# Altium schematic sheet SHEET1.SCHDOC
size A4
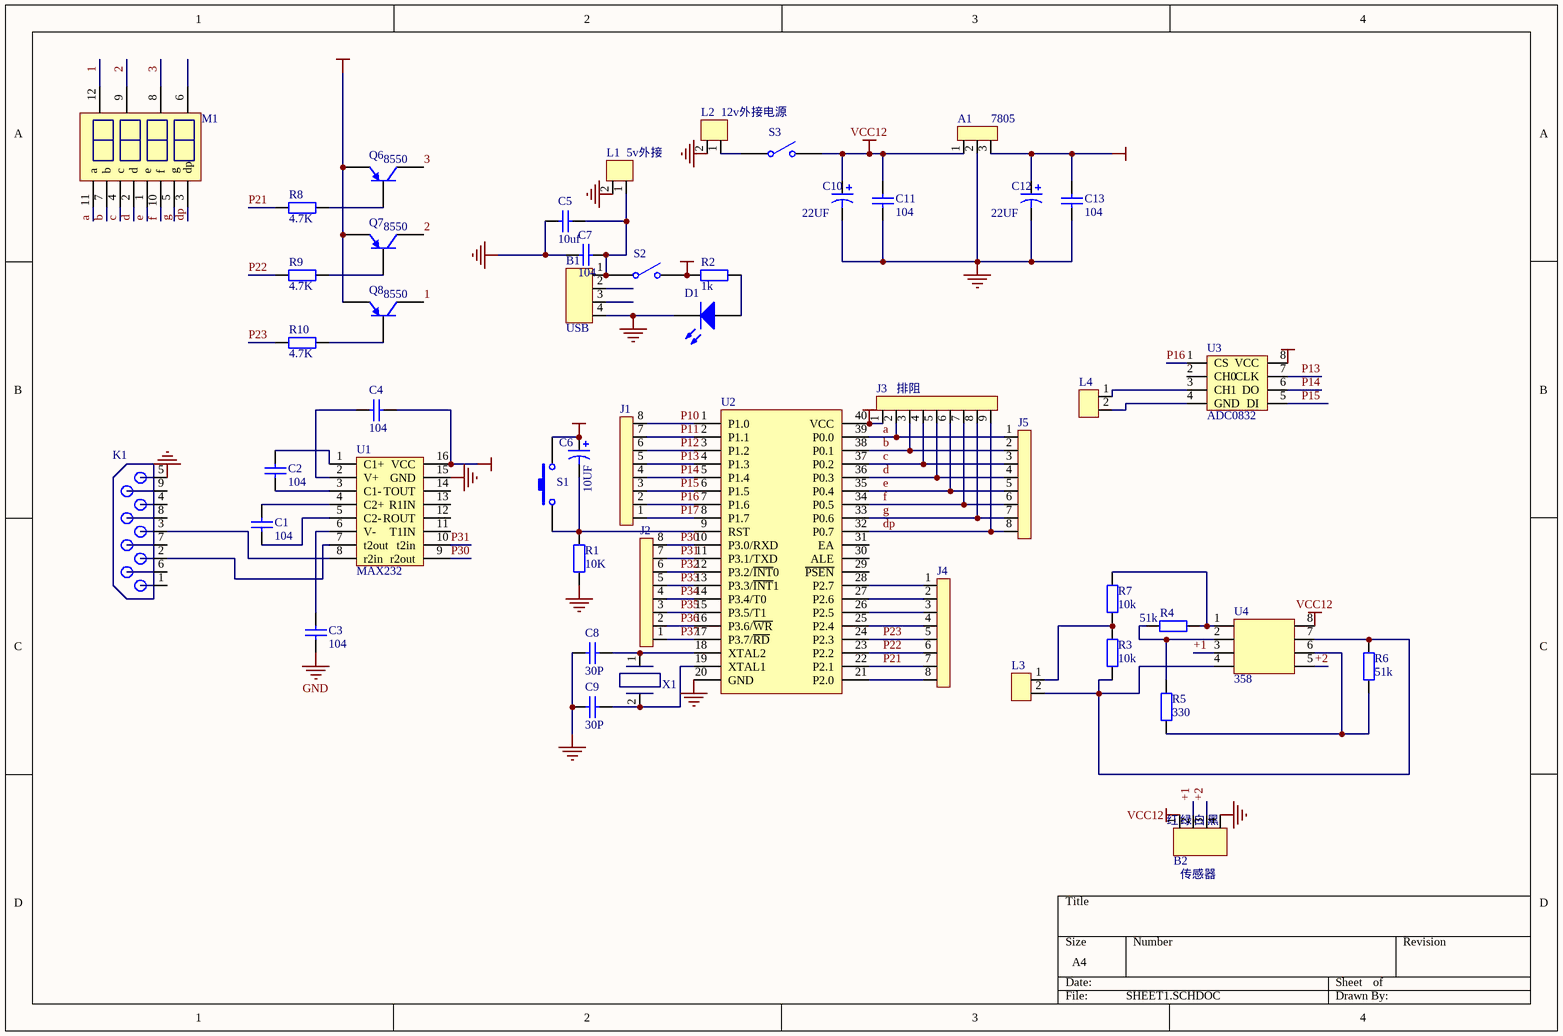
[diagram p0: SHEET1.SCHDOC]

## Parts
A1  7805  [P-3]
B1  USB  [USB]
B2  传感器  [P-4]
C1  104  [P-2]
C2  104  [P-2]
C3  104  [P-2]
C4  104  [P-2]
C5  10uf  [P-2]
C6  10UF  [P-2有源]
C7  104  [P-2]
C8  30P  [P-2]
C9  30P  [P-2]
C10  22UF  [P-2有源]
C11  104  [P-2]
C12  22UF  [P-2有源]
C13  104  [P-2]
D1  HLMA-PH00-N0014  [P-2有源]  (value not drawn)
J1  P-8  [P-8]  (value not drawn)
J2  P-8  [P-8]  (value not drawn)
J3  排阻  [P-9]
J4  P-8  [P-8]  (value not drawn)
J5  P-8  [P-8]  (value not drawn)
K1  串口  [串口]  (value not drawn)
L1  5v外接  [P-2]
L2  12v外接电源  [P-2]
L3  12v外接电源  [P-2]  (value not drawn)
L4  12v外接电源  [P-2]  (value not drawn)
M1  数码管  [数码管]  (value not drawn)
Q6  8550  [P-3]
Q7  8550  [P-3]
Q8  8550  [P-3]
R1  10K  [电阻]
R2  1k  [电阻]
R3  10k  [电阻]
R4  51k  [电阻]
R5  330  [电阻]
R6  51k  [电阻]
R7  10k  [电阻]
R8  4.7K  [电阻]
R9  4.7K  [电阻]
R10  4.7K  [电阻]
S1  SW-PB  [按键]  (value not drawn)
S2  SW-SPST  [LOCK KEY]  (value not drawn)
S3  SW-SPST  [LOCK KEY]  (value not drawn)
U1  MAX232  [DIP-16]
U2  89C52  [单片机]  (value not drawn)
U3  ADC0832  [DIP-8]
U4  358  [DIP-8]
X1  晶振  [晶振]  (value not drawn)

## Nets
GND: A1.2 B1.4(e) B2.4(e) C3.1 C5.1 C7.1 C8.1 C9.1 C10.2 C11.1 C12.2 C13.1 D1.2(K) K1.5 L1.2(SER) L2.2(SER) R1.1 U1.15(GND) U2.20(GND)
VCC: A1.3 C4.2 C6.1 C12.1 C13.2 J3.1(e) Q6.1(E) Q7.1(E) Q8.1(E) R2.1 S1.2 S2.2(NO) U1.16(VCC) U2.40(VCC) U3.8(VCC)
VCC12: A1.1 B2.1(e) C10.1 C11.2 S3.2(NO) U4.8
1: M1.12(dp) Q8.3(C)
2: M1.9(dp) Q7.3(C)
3: M1.8(dp) Q6.3(C)
+1: B2.2(e) U4.3
+2: B2.3(e) U4.5
a: J3.2(e) J5.1(SER) M1.11(a) U2.39(P0.0)
b: J3.3(e) J5.2(SER) M1.7(b) U2.38(P0.1)
c: J3.4(e) J5.3(SER) M1.4(c) U2.37(P0.2)
d: J3.5(e) J5.4(SER) M1.2(d) U2.36(P0.3)
dp: J3.9(e) J5.8(SER) M1.3(dp) U2.32(P0.7)
e: J3.6(e) J5.5(SER) M1.1(e) U2.35(P0.4)
f: J3.7(e) J5.6(SER) M1.10(f) U2.34(P0.5)
g: J3.8(e) J5.7(SER) M1.5(g) U2.33(P0.6)
P10: J1.8(SER) U2.1(P1.0)
P11: J1.7(SER) U2.2(P1.1)
P12: J1.6(SER) U2.3(P1.2)
P13: J1.5(SER) U2.4(P1.3) U3.7(CLK)
P14: J1.4(SER) U2.5(P1.4) U3.6(DO)
P15: J1.3(SER) U2.6(P1.5) U3.5(DI)
P16: J1.2(SER) U2.7(P1.6) U3.1(CS)
P17: J1.1(SER) U2.8(P1.7)
P21: J4.7(SER) R8.2 U2.22(P2.1)
P22: J4.6(SER) R9.2 U2.23(P2.2)
P23: J4.5(SER) R10.2 U2.24(P2.3)
P30: J2.8(SER) U1.9(r2out) U2.10(P3.0/RXD)
P31: J2.7(SER) U1.10(t2in) U2.11(P3.1/TXD)
P32: J2.6(SER) U2.12(P3.2/~{INT}0)
P33: J2.5(SER) U2.13(P3.3/~{INT}1)
P34: J2.4(SER) U2.14(P3.4/T0)
P35: J2.3(SER) U2.15(P3.5/T1)
P36: J2.2(SER) U2.16(P3.6/~{WR})
P37: J2.1(SER) U2.17(P3.7/~{RD})
NetB1_1: B1.1(e) C5.2 C7.2 L1.1(SER) S2.1(COMMON)
NetC1_1: C1.1 U1.4(C2+)
NetC1_2: C1.2 U1.5(C2-)
NetC2_1: C2.1 U1.1(C1+)
NetC2_2: C2.2 U1.3(C1-)
NetC3_2: C3.2 U1.6(V-)
NetC4_1: C4.1 U1.2(V+)
NetC6_2: C6.2 R1.2 S1.1 U2.9(RST)
NetC8_2: C8.2 U2.18(XTAL2) X1.1(e)
NetC9_2: C9.2 U2.19(XTAL1) X1.2(e)
NetD1_1: D1.1(A) R2.2
NetJ4_1: J4.1(SER) U2.28(P2.7)
NetJ4_2: J4.2(SER) U2.27(P2.6)
NetJ4_3: J4.3(SER) U2.26(P2.5)
NetJ4_4: J4.4(SER) U2.25(P2.4)
NetJ4_8: J4.8(SER) U2.21(P2.0)
NetK1_2: K1.2 U1.7(t2out)
NetK1_3: K1.3 U1.8(r2in)
NetL2_1: L2.1(SER) S3.1(COMMON)
NetL3_1: L3.1(SER) R3.1 R7.2
NetL3_2: L3.2(SER) R3.2 R6.2 U4.4 U4.7
NetL4_1: L4.1(SER) U3.3(CH1)
NetL4_2: L4.2(SER) U3.4(GND)
NetQ6_2: Q6.2(B) R8.1
NetQ7_2: Q7.2(B) R9.1
NetQ8_2: Q8.2(B) R10.1
NetR4_1: R4.1 R7.1 U4.1
NetR4_2: R4.2 R5.2 U4.2
NetR5_1: R5.1 R6.1 U4.6

Not connected (* = marked no-connect by the designer): B1 2(e) 3(e); K1 1 4 6 7 8 9; M1 6(dp); U1 11(T1IN) 12(ROUT) 13(R1IN) 14(TOUT); U2 29(~{PSEN}) 30(ALE) 31(EA); U3 2(CH0)

## Notes on the sheet
- (near B2) 红
- (near B2) 绿
- (near B2) 白
- (near B2) 黑

## Library data of the parts
A1 = P-3
B2 = USB
C1-C5 C7-C9 C11 C13 = Cap: Capacitor; Value: 0.01uF; Published: 8-Jun-2000; LatestRevisionDate: 17-Jul-2002; LatestRevisionNote: Re-released for DXP Platform.; PackageReference: RAD-0.3; Publisher: Altium Limited
C6 C10 C12 = Cap Pol1: Polarized Capacitor (Radial); Value: 1uF; Published: 8-Jun-2000; LatestRevisionDate: 17-Jul-2002; LatestRevisionNote: Re-released for DXP Platform.; PackageReference: RB7.6-15; Publisher: Altium Limited
D1 = HLMA-PH00-N0014: Subminiature High Performance AlInGaP Red/Orange LED Lamp; LuminousIntensity: 25mcd (Minimum).; LED_Colour: Red & Orange; PCB_Layout: Complies with manufacturer's recommendation.; Published: 11-Dec-2002; LatestRevisionDate: 19-Mar-2004; LatestRevisionNote: Silkscreen size reduced.; DatasheetDocument: 24-Oct-2001; PackageDocument: 19-Apr-2001; PackageReference: 2.2X2.1X2.2; Publisher: Altium Limited; ComponentLink1Description: Manufacturer Link; ComponentLink1URL: http://www.agilent.com/; ComponentLink2Description: Datasheet; ComponentLink2URL: http://cp.literature.agilent.com/litweb/pdf/5988-4548EN.pdf
J3 = P-9
L1-L4 = P-2
Q6-Q8 = 2N3906: PNP General Purpose Amplifier; Published: 8-Jun-2000; LatestRevisionDate: 15-Jan-2003; LatestRevisionNote: PCB Footprint 'BCY-W3/D4.7' replaced; DatasheetDocument: 1997; PackageDocument: Sep-1998; PackageReference: TO-92A; Publisher: Altium Limited; Code_JEDEC: TO-92A; ComponentLink1Description: Manufacturer Link; ComponentLink1URL: http://www.fairchildsemi.com/; ComponentLink2Description: Datasheet; ComponentLink2URL: http://www.fairchildsemi.com/ds/2N%2F2N3906.pdf
R1 R3-R10 = Res2: Resistor; Value: 1K; Published: 8-Jun-2000; LatestRevisionDate: 17-Jul-2002; LatestRevisionNote: Re-released for DXP Platform.; PackageReference: AXIAL-0.4; Publisher: Altium Limited
R2 = Res2: Resistor; Published: 8-Jun-2000; LatestRevisionDate: 17-Jul-2002; LatestRevisionNote: Re-released for DXP Platform.; PackageReference: AXIAL-0.4; Publisher: Altium Limited; Value: 1K
S1 = SW-PB: Switch; Published: 24-Mar-1999; LatestRevisionDate: 17-Jul-2002; LatestRevisionNote: Re-released for DXP Platform.; PackageReference: SPST-2; Publisher: Altium Limited
S2 S3 = SW-SPST: Single-Pole, Single-Throw Switch; Published: 24-Mar-1999; LatestRevisionDate: 17-Jul-2002; LatestRevisionNote: Re-released for DXP Platform.; PackageReference: SPST-2; Publisher: Altium Limited
U4 = ADC0832